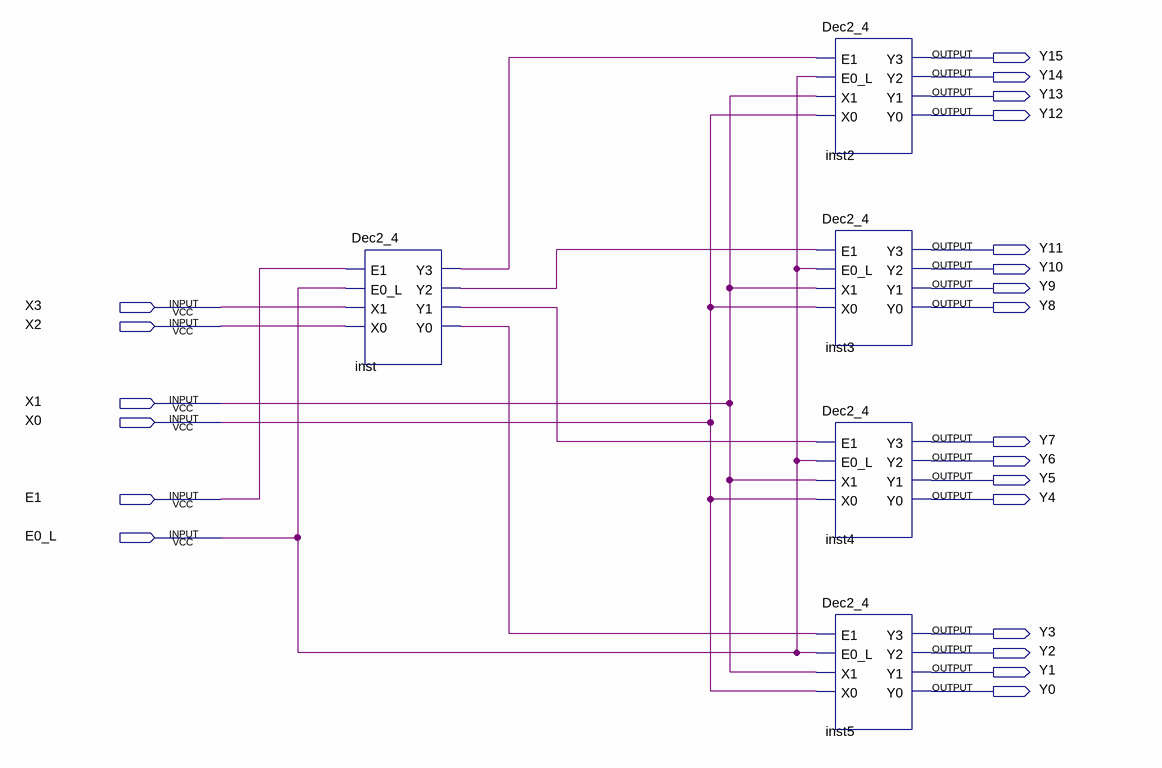
[diagram p0: schematic sheet]
// Quartus schematic Dec4_16.bdf as structural Verilog: 5 symbols, 22 pins
module Dec4_16 (
  input  X3,
  input  X2,
  input  X1,
  input  X0,
  input  E1,
  input  E0_L,
  output Y15,
  output Y14,
  output Y13,
  output Y12,
  output Y11,
  output Y10,
  output Y9,
  output Y8,
  output Y7,
  output Y6,
  output Y5,
  output Y4,
  output Y3,
  output Y2,
  output Y1,
  output Y0
);

  wire inst_y0, inst_y1, inst_y2, inst_y3;

  Dec2_4 inst (.E1(E1), .E0_L(E0_L), .X1(X3), .X0(X2), .Y3(inst_y3), .Y2(inst_y2), .Y1(inst_y1), .Y0(inst_y0));
  Dec2_4 inst2 (.E1(inst_y3), .E0_L(E0_L), .X1(X1), .X0(X0), .Y3(Y15), .Y2(Y14), .Y1(Y13), .Y0(Y12));
  Dec2_4 inst3 (.E1(inst_y2), .E0_L(E0_L), .X1(X1), .X0(X0), .Y3(Y11), .Y2(Y10), .Y1(Y9), .Y0(Y8));
  Dec2_4 inst4 (.E1(inst_y1), .E0_L(E0_L), .X1(X1), .X0(X0), .Y3(Y7), .Y2(Y6), .Y1(Y5), .Y0(Y4));
  Dec2_4 inst5 (.E1(inst_y0), .E0_L(E0_L), .X1(X1), .X0(X0), .Y3(Y3), .Y2(Y2), .Y1(Y1), .Y0(Y0));
endmodule
